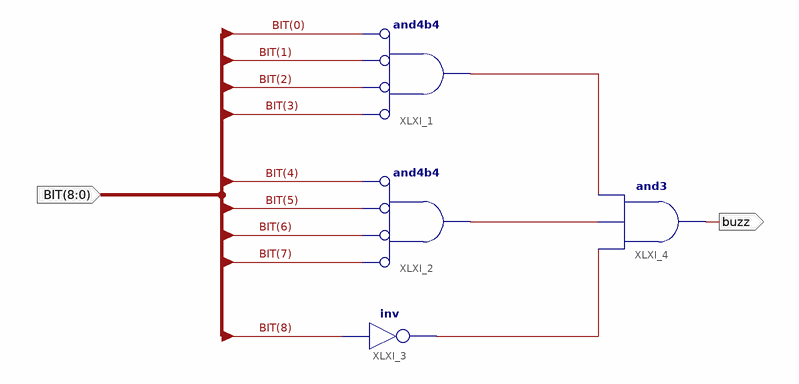
[diagram p0: schematic sheet 1]
// Xilinx ISE schematic Compare.sch (spartan6) as structural Verilog: 4 symbols, 2 ports
module Compare (
  input  [8:0] BIT,
  output buzz
);

  wire XLXN_15, XLXN_16, XLXN_17;

  and XLXI_1 (XLXN_15, ~BIT[3], ~BIT[2], ~BIT[1], ~BIT[0]);  // and4b4
  and XLXI_2 (XLXN_16, ~BIT[7], ~BIT[6], ~BIT[5], ~BIT[4]);  // and4b4
  not XLXI_3 (XLXN_17, BIT[8]);
  and XLXI_4 (buzz, XLXN_17, XLXN_16, XLXN_15);
endmodule
